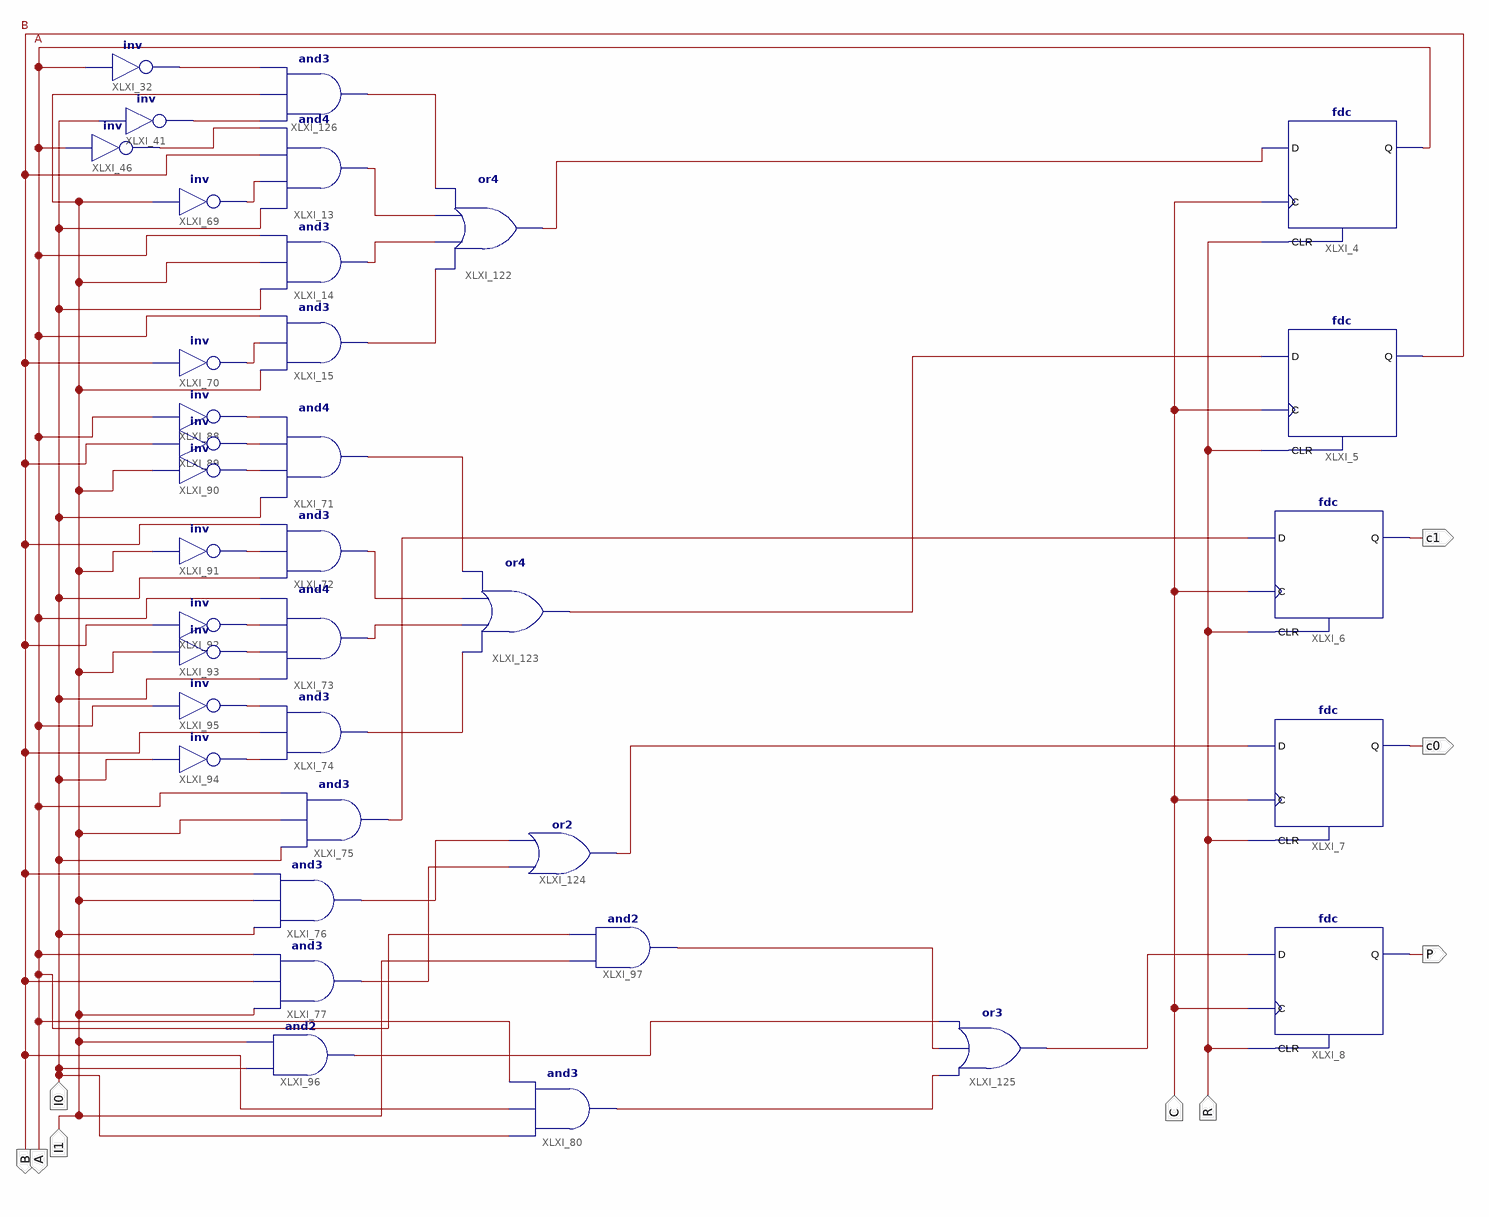
[diagram p0: schematic sheet 1]
// Xilinx ISE schematic schm.sch (spartan3e) as structural Verilog: 36 symbols, 9 ports
module schm (
  input  I0,
  input  I1,
  input  C,
  input  R,
  output c1,
  output c0,
  output P,
  output B,
  output A
);

  wire cc0, cc1, SA, SB, XLXN_13, XLXN_16, XLXN_30, XLXN_75, XLXN_85, XLXN_86, XLXN_87, XLXN_88, XLXN_89,
       XLXN_90, XLXN_91, XLXN_92, XLXN_94, XLXN_122, XLXN_123, XLXN_124, XLXN_125, XLXN_126, XLXN_137,
       XLXN_138, XLXN_139, XLXN_144, XLXN_145, XLXN_153, XLXN_154, XLXN_155, XLXN_180;

  fdc XLXI_6 (.C(C), .CLR(R), .D(cc1), .Q(c1));
  fdc XLXI_7 (.C(C), .CLR(R), .D(cc0), .Q(c0));
  fdc XLXI_8 (.C(C), .CLR(R), .D(XLXN_180), .Q(P));
  fdc XLXI_4 (.C(C), .CLR(R), .D(SA), .Q(A));
  fdc XLXI_5 (.C(C), .CLR(R), .D(SB), .Q(B));
  and XLXI_14 (XLXN_124, I0, I1, A);
  and XLXI_15 (XLXN_125, I1, XLXN_85, A);
  and XLXI_13 (XLXN_123, I0, XLXN_75, B, XLXN_30);
  not XLXI_46 (XLXN_30, A);
  not XLXI_32 (XLXN_13, A);
  not XLXI_69 (XLXN_75, I1);
  not XLXI_70 (XLXN_85, B);
  not XLXI_88 (XLXN_86, A);
  not XLXI_89 (XLXN_87, B);
  not XLXI_90 (XLXN_88, I1);
  and XLXI_71 (XLXN_126, I0, XLXN_88, XLXN_87, XLXN_86);
  and XLXI_72 (XLXN_137, I0, XLXN_89, B);
  and XLXI_73 (XLXN_138, I0, XLXN_91, XLXN_90, A);
  and XLXI_74 (XLXN_139, XLXN_92, B, XLXN_94);
  not XLXI_92 (XLXN_90, B);
  not XLXI_93 (XLXN_91, I1);
  not XLXI_94 (XLXN_92, I0);
  not XLXI_91 (XLXN_89, I1);
  not XLXI_95 (XLXN_94, A);
  and XLXI_96 (XLXN_153, I0, I1);
  and XLXI_77 (XLXN_145, I1, B, A);
  and XLXI_76 (XLXN_144, I0, I1, B);
  and XLXI_75 (cc1, I0, I1, A);
  or XLXI_122 (SA, XLXN_125, XLXN_124, XLXN_123, XLXN_122);
  or XLXI_123 (SB, XLXN_139, XLXN_138, XLXN_137, XLXN_126);
  or XLXI_125 (XLXN_180, XLXN_155, XLXN_154, XLXN_153);
  or XLXI_124 (cc0, XLXN_145, XLXN_144);
  and XLXI_80 (XLXN_155, I0, B, A);
  and XLXI_97 (XLXN_154, I1, A);
  not XLXI_41 (XLXN_16, I0);
  and XLXI_126 (XLXN_122, XLXN_16, I1, XLXN_13);
endmodule
